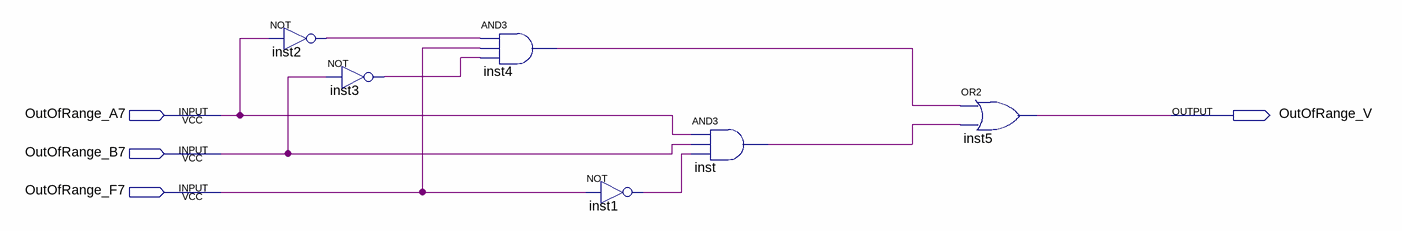
[diagram p0: schematic sheet]
// Quartus schematic OutOfRange.bdf as structural Verilog: 6 symbols, 4 pins
module OutOfRange (
  input  OutOfRange_A7,
  input  OutOfRange_B7,
  input  OutOfRange_F7,
  output OutOfRange_V
);

  wire inst1_out, inst2_out, inst3_out, inst4_out, inst_out;

  not inst2 (inst2_out, OutOfRange_A7);
  not inst3 (inst3_out, OutOfRange_B7);
  and inst4 (inst4_out, inst2_out, OutOfRange_F7, inst3_out);
  not inst1 (inst1_out, OutOfRange_F7);
  and inst (inst_out, OutOfRange_A7, OutOfRange_B7, inst1_out);
  or inst5 (OutOfRange_V, inst4_out, inst_out);
endmodule
